# Altium schematic sheet TF CARD.SchDoc
size A
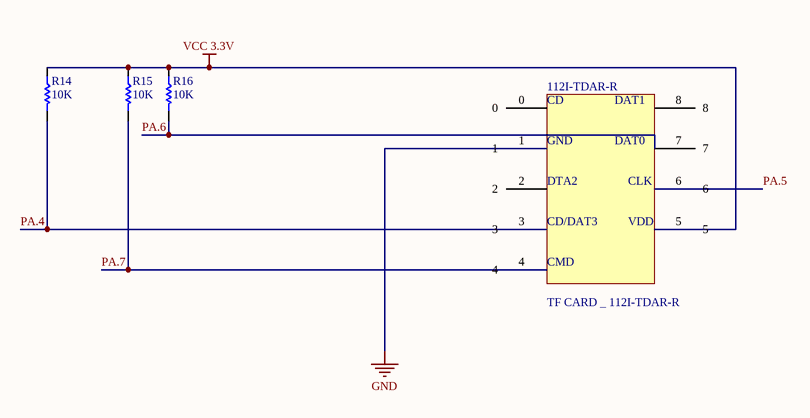
[diagram p0: TF CARD.SchDoc]

## Parts
112I-TDAR-R  ATTEND  [PCBComponent_1]  (value not drawn)
R14  10K  [SMD_RES_0805]
R15  10K  [SMD_RES_0805]
R16  10K  [SMD_RES_0805]

## Nets
GND: 112I-TDAR-R.1
VCC 3.3V: 112I-TDAR-R.5 R14.1 R15.1 R16.1
PA.4: 112I-TDAR-R.3 R14.2
PA.5: 112I-TDAR-R.6
PA.6: 112I-TDAR-R.7 R16.2
PA.7: 112I-TDAR-R.4 R15.2

Not connected (* = marked no-connect by the designer): 112I-TDAR-R 0 2 8

## Notes on the sheet
- (in symbol Component_1) CD; DAT1; GND; DAT0; DTA2; CLK; CD/DAT3; VDD; CMD; TF CARD _ 112I-TDAR-R

## Library data of the parts
112I-TDAR-R = Component_1
R14-R16 = Resistor: Tolerance: 5%; Power: 1/8 W; Value: 10K